# Altium schematic sheet ETH_RJ45.SchDoc: ETH RJ45
size A3; Author: Silvio Navaretti; CompanyName: ARDUINO; DrawnBy: Silvio Navaretti; Engineer: Silvio Navaretti; Organization: ARDUINO; SheetNumber: 37; SheetTotal: 51; RevAuthor: Silvio Navaretti
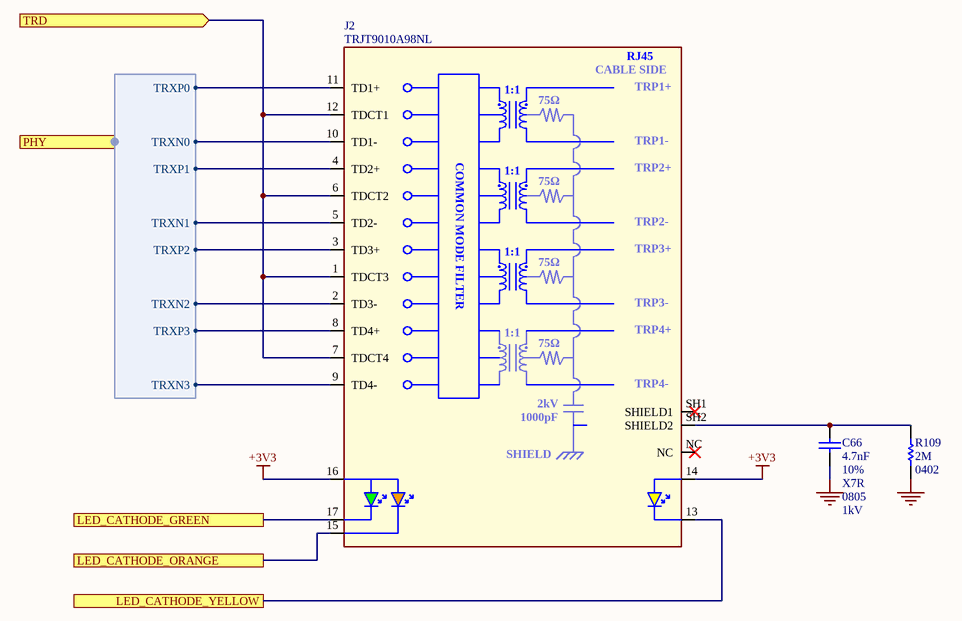
[diagram p0: ETH_RJ45.SchDoc]

## Parts
C66  value 4.7nF  Tolerance: 10%  Dielectric: X7R  Case Code (Imperial): 0805  Voltage: 1kV  [CAP-0805]  (hidden comment: FV21X472K102ECG)
J2  TRJT9010A98NL  [TRJT9010A98NL]
R109  value 2M  Case Code (Imperial): 0402  [RES-0402]  (hidden comment: RC0402FR-072ML)

## Ports
LED_CATHODE_GREEN, LED_CATHODE_ORANGE, LED_CATHODE_YELLOW, PHY (harness ETH_QCA8081), TRD (in)

## Harnesses
ETH_QCA8081: TRXP1, TRXN1, TRXP0, TRXN0, TRXP2, TRXN2, TRXP3, TRXN3

## Nets
+3V3: J2.14(YELLOW_ANODE) J2.16(COMMON_ANODE)
GND: C66.2 R109.1
LED_CATHODE_GREEN: J2.17(GREEN_CATHODE) ; port LED_CATHODE_GREEN
LED_CATHODE_ORANGE: J2.15(ORANGE_CATHODE) ; port LED_CATHODE_ORANGE
LED_CATHODE_YELLOW: J2.13(YELLOW_CATHODE) ; port LED_CATHODE_YELLOW
TRD: J2.1(TDCT3) J2.6(TDCT2) J2.7(TDCT4) J2.12(TDCT1) ; port TRD
NetC66_1: C66.1 J2.SH2(SHIELD2) R109.2
NetJ2_2: J2.2(TD3-) ; port PHY.TRXN2
NetJ2_3: J2.3(TD3+) ; port PHY.TRXP2
NetJ2_4: J2.4(TD2+) ; port PHY.TRXP1
NetJ2_5: J2.5(TD2-) ; port PHY.TRXN1
NetJ2_8: J2.8(TD4+) ; port PHY.TRXP3
NetJ2_9: J2.9(TD4-) ; port PHY.TRXN3
NetJ2_10: J2.10(TD1-) ; port PHY.TRXN0
NetJ2_11: J2.11(TD1+) ; port PHY.TRXP0

Not connected (* = marked no-connect by the designer): J2 NC* SH1(SHIELD1)*

## Notes on the sheet
- Title:
- ID:
- Date:
- Time:
- Version:
- Sheet
- of
- RevAuthor:
- Reference Designs ARE PROVIDED "AS IS" AND "WITH ALL FAULTS. Arduino SA DISCLAIMS ALL OTHER WARRANTIES, EXPRESS OR IMPLIED, REGARDING PRODUCTS, INCLUDING BUT NOT LIMITED TO, ANY IMPLIED WARRANTIES OF MERCHANTABILITY OR FITNESS FOR A PARTICULAR PURPOSE.
  Arduino SA may make changes to specifications and product descriptions at any time, without notice. The Customer must not rely on the absence or characteristics of any features or instructions marked "reserved" or "undefined".
  Arduino SA reserves these for future definition and shall have no responsibility whatsoever for conflicts or incompatibilities arising from future changes to them. The product information on the Web Site or Materials is subject to change without notice.
  Do not finalize a design with this info. ARDUINO and other Arduino brands and logos and Trademarks of Arduino SA. All Arduino SA Trademarks cannot be used without owner's formal permission.
- File:
- Author:
- (in symbol J0561-A.4) RJ45; CABLE SIDE; TRP1+; 1:1; 75Ω; TRP1-; TRP2+; TRP2-; COMMON MODE FILTER; TRP3+; TRP3-; TRP4+; TRP4-; 2kV; 1000pF; SHIELD

## Library data of the parts
C66 = C0059-A.14: CAP CHIP 0805 4.7nF 10% 1000V X7R; Manufacturer: PSA Shenzen; Code Arduino: 0689; Technology: Ceramic; Manufacturer 3: KEMET; Manufacturer 2: KEMET; Part number 2: C0805V472KDRACTU; Part number 3: C0805C472KDRACTU; Part Number: FV21X472K102ECG
J2 = J0561-A.4: CONN ETH 1x1 RJ45 TH 10/100/1000/2500 integrated magnetics, LED GREEN/YELLOW/ORANGE, micro profile 17.8x24.2x11.55mm; Manufacturer: TRXCOM; Code Arduino: J0561; Part Number: TRJT9010A98NL
R109 = R0394-A.1: RES CHIP 0402 2M 1% 1/16W; Manufacturer: YAGEO; Temperature coefficient: 100ppm; Code Arduino: R0394; Power: 62.5mW; Technology: Thick film; Part Number: RC0402FR-072ML; Tolerance: 1%